# EAGLE design Lightpack5.6 (EAGLE 6.2)
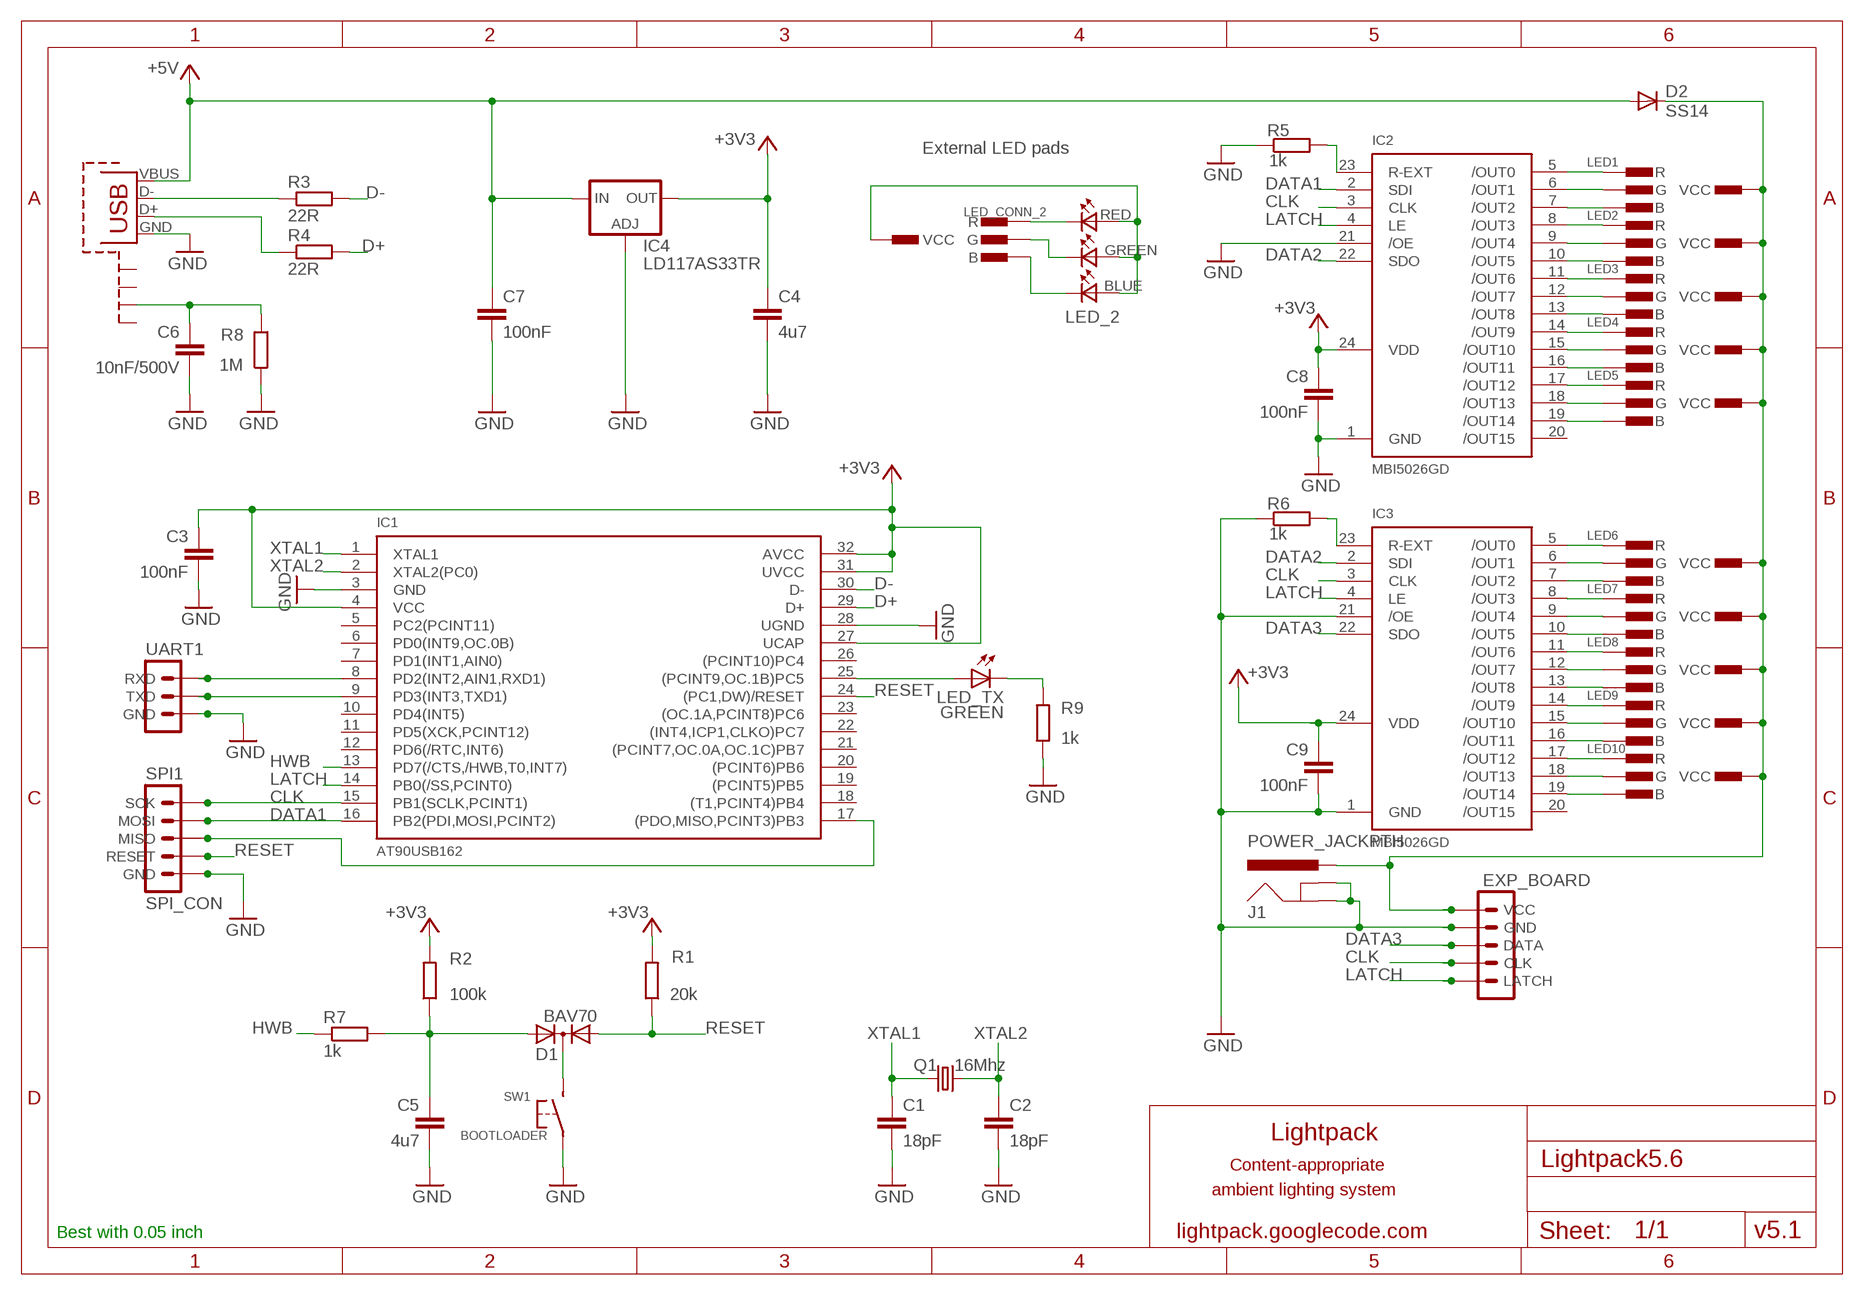
[diagram p0: schematic, sheet 1]

## Parts
C1  18pF  C-EUC1206  [C1206]
C2  18pF  C-EUC1206  [C1206]
C3  100nF  C-EUC1206  [C1206]
C4  4u7  C-EUC1206  [C1206]
C5  4u7  C-EUC1206  [C1206]
C6  10nF/500V  C-EUC1206  [C1206]
C7  100nF  C-EUC1206  [C1206]
C8  100nF  C-EUC1206  [C1206]
C9  100nF  C-EUC1206  [C1206]
D1  BAV70  DIODE-2AC|CASOT23  [SOT23]
D2  SS14  DIODE-SMB  [SMB]
EXP_BOARD  MA05-1  [MA05-1]
IC1  AT90USB162  [TQFP32]
IC2  MBI5026GD  [SOP24-300-1.27]
IC3  MBI5026GD  [SOP24-300-1.27]
IC4  LD117AS33TR  [SOT223]
J1  POWER_JACKPTH  [POWER_JACK_PTH]
LED1  CON-RGB-LED  CON-RGB-LED-TH  [CON-RGB-LED-TH]
LED2  CON-RGB-LED  CON-RGB-LED-TH  [CON-RGB-LED-TH]
LED3  CON-RGB-LED  CON-RGB-LED-TH  [CON-RGB-LED-TH]
LED4  CON-RGB-LED  CON-RGB-LED-TH  [CON-RGB-LED-TH]
LED5  CON-RGB-LED  CON-RGB-LED-TH  [CON-RGB-LED-TH]
LED6  CON-RGB-LED  CON-RGB-LED-TH  [CON-RGB-LED-TH]
LED7  CON-RGB-LED  CON-RGB-LED-TH  [CON-RGB-LED-TH]
LED8  CON-RGB-LED  CON-RGB-LED-TH  [CON-RGB-LED-TH]
LED9  CON-RGB-LED  CON-RGB-LED-TH  [CON-RGB-LED-TH]
LED10  CON-RGB-LED  CON-RGB-LED-TH  [CON-RGB-LED-TH]
LED_2  TOPLED-3RF-W2SA50TS  [LP2C63-ST-RGB-SR0]
LED_CONN_2  CON-RGB-LED  CON-RGB-LED-EXT  [CON-RGB-LED-TH-EXT]
LED_TX  GREEN  LEDCHIPLED_0805  [CHIPLED_0805]
Q1  16Mhz  CRYSTALHC49UP  [HC49UP]
R1  20k  R-EU_R1206  [R1206]
R2  100k  R-EU_R1206_2  [R1206]
R3  22R  R-EU_R1206  [R1206]
R4  22R  R-EU_R1206  [R1206]
R5  1k  R-EU_R1206  [R1206]
R6  1k  R-EU_R1206  [R1206]
R7  1k  R-EU_R1206  [R1206]
R8  1M  R-EU_R1206  [R1206]
R9  1k  R-EU_R1206  [R1206]
SPI1  SPI_CON  [NXT_BRD]
SW1  BOOTLOADER  BUTTON  [BUTTON-SMD]
UART1  UART3  [UART3]
X1  USB-MB-S  [USB-MB-S]

## Nets
+3V3 [VCC]: C3.1 C4.1 C8.1 C9.1 IC1.4(VCC) IC1.27(UCAP) IC1.31(UVCC) IC1.32(AVCC) IC2.24(VDD) IC3.24(VDD) IC4.4(OUT) R1.2 R2.1
+5V [VCC]: C7.1 D2.A IC4.3(IN) X1.VBUS
CLK: EXP_BOARD.2(CLK) IC1.15(PB1(SCLK,PCINT1)) IC2.3(CLK) IC3.3(CLK) SPI1.2(SCK)
D+: IC1.29(D+) R4.2
D-: IC1.30(D-) R3.2
DATA1: IC1.16(PB2(PDI,MOSI,PCINT2)) IC2.2(SDI) SPI1.3(MOSI)
DATA2: IC2.22(SDO) IC3.2(SDI)
DATA3: EXP_BOARD.3(DATA) IC3.22(SDO)
GND: C1.2 C2.2 C3.2 C4.2 C5.2 C6.2 C7.2 C8.2 C9.2 EXP_BOARD.4(GND) IC1.3(GND) IC1.28(UGND) IC2.1(GND) IC2.21(/OE) IC3.1(GND) IC3.21(/OE) IC4.1(ADJ) J1.GND J1.GNDBREAK R5.1 R6.1 R8.1 R9.1 SPI1.1-L(GND) SW1.1 UART1.1-L(GND) X1.GND
HWB: IC1.13(PD7(/CTS,/HWB,T0,INT7)) R7.1
LATCH: EXP_BOARD.1(LATCH) IC1.14(PB0(/SS,PCINT0)) IC2.4(LE) IC3.4(LE)
N$1: IC2.23(R-EXT) R5.2
N$2: IC3.8(/OUT3) LED7.3.R(R)
N$3: IC1.17((PDO,MISO,PCINT3)PB3) SPI1.4(MISO)
N$4: IC1.8(PD2(INT2,AIN1,RXD1)) UART1.2(RXD)
N$5: IC2.5(/OUT0) LED1.3.R(R)
N$6: IC2.6(/OUT1) LED1.2.G(G)
N$7: IC2.7(/OUT2) LED1.1.B(B)
N$8: IC1.25((PCINT9,OC.1B)PC5) LED_TX.A
N$9: IC2.8(/OUT3) LED2.3.R(R)
N$10: IC2.9(/OUT4) LED2.2.G(G)
N$11: IC2.10(/OUT5) LED2.1.B(B)
N$12: IC2.11(/OUT6) LED3.3.R(R)
N$13: IC2.12(/OUT7) LED3.2.G(G)
N$14: IC2.13(/OUT8) LED3.1.B(B)
N$15: IC2.14(/OUT9) LED4.3.R(R)
N$16: IC1.9(PD3(INT3,TXD1)) UART1.3-R(TXD)
N$18: IC3.5(/OUT0) LED6.3.R(R)
N$19: IC3.6(/OUT1) LED6.2.G(G)
N$20: IC3.7(/OUT2) LED6.1.B(B)
N$21: IC3.9(/OUT4) LED7.2.G(G)
N$22: IC3.10(/OUT5) LED7.1.B(B)
N$23: IC3.11(/OUT6) LED8.3.R(R)
N$24: IC3.12(/OUT7) LED8.2.G(G)
N$25: IC3.14(/OUT9) LED9.3.R(R)
N$26: IC3.13(/OUT8) LED8.1.B(B)
N$27: IC3.15(/OUT10) LED9.2.G(G)
N$28: IC3.16(/OUT11) LED9.1.B(B)
N$29: IC2.15(/OUT10) LED4.2.G(G)
N$30: IC2.16(/OUT11) LED4.1.B(B)
N$31: IC3.23(R-EXT) R6.2
N$32: R3.1 X1.D-
N$33: R4.1 X1.D+
N$37: LED_TX.C R9.2
N$38: IC2.17(/OUT12) LED5.3.R(R)
N$39: IC2.18(/OUT13) LED5.2.G(G)
N$40: IC2.19(/OUT14) LED5.1.B(B)
N$41: IC3.17(/OUT12) LED10.3.R(R)
N$42: IC3.18(/OUT13) LED10.2.G(G)
N$43: IC3.19(/OUT14) LED10.1.B(B)
N$44: C6.1 R8.2 X1.SHIELD3
N$45: D1.3(C) SW1.2
N$47: C5.1 D1.2(A2) R2.2 R7.2
N$50: LED_2.CRED LED_CONN_2.3.R(R)
N$51: LED_2.CGREEN LED_CONN_2.2.G(G)
N$52: LED_2.CBLUE LED_CONN_2.1.B(B)
N$54: LED_2.BLUE LED_2.GREEN LED_2.RED LED_CONN_2.4.VCC(VCC)
N$57 [VCC]: D2.C EXP_BOARD.5(VCC) J1.PWR LED1.4.VCC(VCC) LED2.4.VCC(VCC) LED3.4.VCC(VCC) LED4.4.VCC(VCC) LED5.4.VCC(VCC) LED6.4.VCC(VCC) LED7.4.VCC(VCC) LED8.4.VCC(VCC) LED9.4.VCC(VCC) LED10.4.VCC(VCC)
RESET: D1.1(A1) IC1.24((PC1,DW)/RESET) R1.1 SPI1.5-R(RESET)
XTAL1: C1.1 IC1.1(XTAL1) Q1.1
XTAL2: C2.1 IC1.2(XTAL2(PC0)) Q1.2
Unconnected: IC1.5(PC2(PCINT11)) IC1.6(PD0(INT9,OC.0B)) IC1.7(PD1(INT1,AIN0)) IC1.10(PD4(INT5)) IC1.11(PD5(XCK,PCINT12)) IC1.12(PD6(/RTC,INT6)) IC1.18((T1,PCINT4)PB4) IC1.19((PCINT5)PB5) IC1.20((PCINT6)PB6) IC1.21((PCINT7,OC.0A,OC.1C)PB7) IC1.22((INT4,ICP1,CLKO)PC7) IC1.23((OC.1A,PCINT8)PC6) IC1.26((PCINT10)PC4) IC2.20(/OUT15) IC3.20(/OUT15) X1.SHIELD1 X1.SHIELD2 X1.SHIELD4

## Notes on the sheet
- External LED pads
- Lightpack
- Content-appropriate
- ambient lighting system
- Best with 0.05 inch | lightpack.googlecode.com | v5.1

## Library data of the parts
C1-C9 = rcl:C-EU: CAPACITOR, European symbol
D1 = diode:DIODE-2AC|CA: Dual DIODE Anode-Cathode|Cathode-Anode
D2 = diode:DIODE-: DIODE
EXP_BOARD = brd-conn:MA05-1: PIN HEADER
IC1 = AT90USB:AT90USB162: AT90USB162 Author: brunql.github.com
IC2 IC3 = MBI5026:MBI5026: MBI5026 Author: brunql.github.com
IC4 = v-reg:LD117A?*: Low drop fixed and adjustable positive voltage regulators 1 A Source: http://www.st.com/stonline/products/literature/ds/7194/ld1117axx.pdf
J1 = SparkFun:POWER_JACK: Power Jack This is the standard 5.5mm barrel jack for power. The PTH is the most common, proven, reliable, footprint. All others are experimental. The Slot footprint only works if the mill layer is transmitted to the PCB fab house so be warned. Spark Fun Electronics SKU : PRT-00119. Mating wall wart : TOL-00298 (and others)
LED1-LED10 LED_CONN_2 = led-rgb:CON-RGB-LED
LED_2 = led-rgb:TOPLED-3: OSRAM Edited: brunql Removed center pad in pcb - Hyper Multi TOPLED® (RGB) LB E673, LV E673, LT E673 - Power TOPLED® Enhanced optical Power LED (HOP2000) LS E67B, LA E67B, LO E67B, LY E67B - Hyper Multi TOPLED® Enhanced optical Power LED (HOP2000 / ATON®) LATB T66B - Hyper Multi TOPLED® Hyper-Bright LED LATB T686 Source: http://www.osram.convergy.de/
LED_TX = led:LED: LED OSRAM: - CHIPLED LG R971, LG N971, LY N971, LG Q971, LY Q971, LO R971, LY R971 LH N974, LH R974 LS Q976, LO Q976, LY Q976 LO Q996 - Hyper CHIPLED LW Q18S LB Q993, LB Q99A, LB R99A - SideLED LS A670, LO A670, LY A670, LG A670, LP A670 LB A673, LV A673, LT A673, LW A673 LH A674 LY A675 LS A676, LA A676, LO A676, LY A676, LW A676 LS A679, LY A679, LG A679 - Hyper Micro SIDELED® LS Y876, LA Y876, LO Y876, LY Y876 LT Y87S - SmartLED LW L88C, LW L88S LB L89C, LB L89S, LG L890 LS L89K, LO L89K, LY L89K LS L896, LA L896, LO L896, LY L896 - TOPLED LS T670, LO T670, LY T670, LG T670, LP T670 LSG T670, LSP T670, LSY T670, LOP T670, LYG T670 LG T671, LOG T671, LSG T671 LB T673, LV T673, LT T673, LW T673 LH T674 LS T676, LA T676, LO T676, LY T676, LB T676, LH T676, LSB T676, LW T676 LB T67C, LV T67C, LT T67C, LS T67K, LO T67K, LY T67K, LW E67C LS E67B, LA E67B, LO E67B, LY E67B, LB E67C, LV E67C, LT E67C LW T67C LS T679, LY T679, LG T679 LS T770, LO T770, LY T770, LG T770, LP T770 LB T773, LV T773, LT T773, LW T773 LH T774 LS E675, LA E675, LY E675, LS T675 LS T776, LA T776, LO T776, LY T776, LB T776 LHGB T686 LT T68C, LB T68C - Hyper Mini TOPLED® LB M676 - Mini TOPLED Santana® LG M470 LS M47K, LO M47K, LY M47K Source: http://www.osram.convergy.de LUXEON: - LUMILED® LXK2-PW12-R00, LXK2-PW12-S00, LXK2-PW14-U00, LXK2-PW14-V00 LXK2-PM12-R00, LXK2-PM12-S00, LXK2-PM14-U00 LXK2-PE12-Q00, LXK2-PE12-R00, LXK2-PE12-S00, LXK2-PE14-T00, LXK2-PE14-U00 LXK2-PB12-K00, LXK2-PB12-L00, LXK2-PB12-M00, LXK2-PB14-N00, LXK2-PB14-P00, LXK2-PB14-Q00 LXK2-PR12-L00, LXK2-PR12-M00, LXK2-PR14-Q00, LXK2-PR14-R00 LXK2-PD12-Q00, LXK2-PD12-R00, LXK2-PD12-S00 LXK2-PH12-R00, LXK2-PH12-S00 LXK2-PL12-P00, LXK2-PL12-Q00, LXK2-PL12-R00 Source: www.luxeon.com KINGBRIGHT: KA-3528ASYC Source: www.kingbright.com
Q1 = crystal:CRYSTAL: CRYSTAL
R1 R2 R5 R6 = br-zero-res:R-EU_: RESISTOR, European symbol
R3 R4 R7-R9 = rcl:R-EU_: RESISTOR, European symbol
SPI1 = brd-conn:SPI_CON
SW1 = button-smd:BUTTON: Button SMD
UART1 = brd-conn:UART3: PIN HEADER
X1 = USB_miniB:USB: USB Connector miniUSB type B

## Net classes
1 VCC: width 0.6 mm, clearance 0.6 mm

## Board
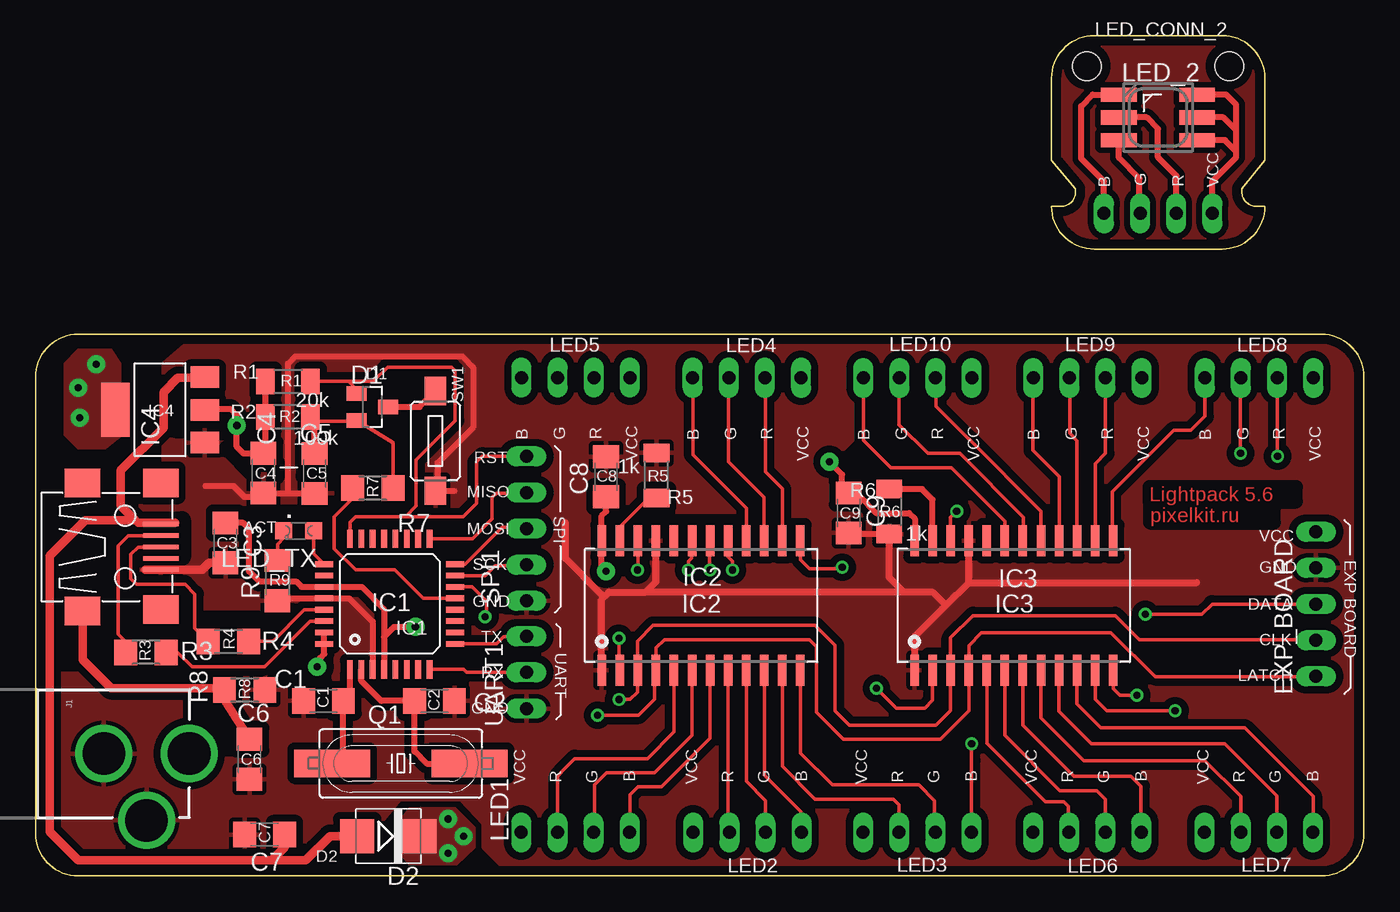
[diagram p1: board, top side]
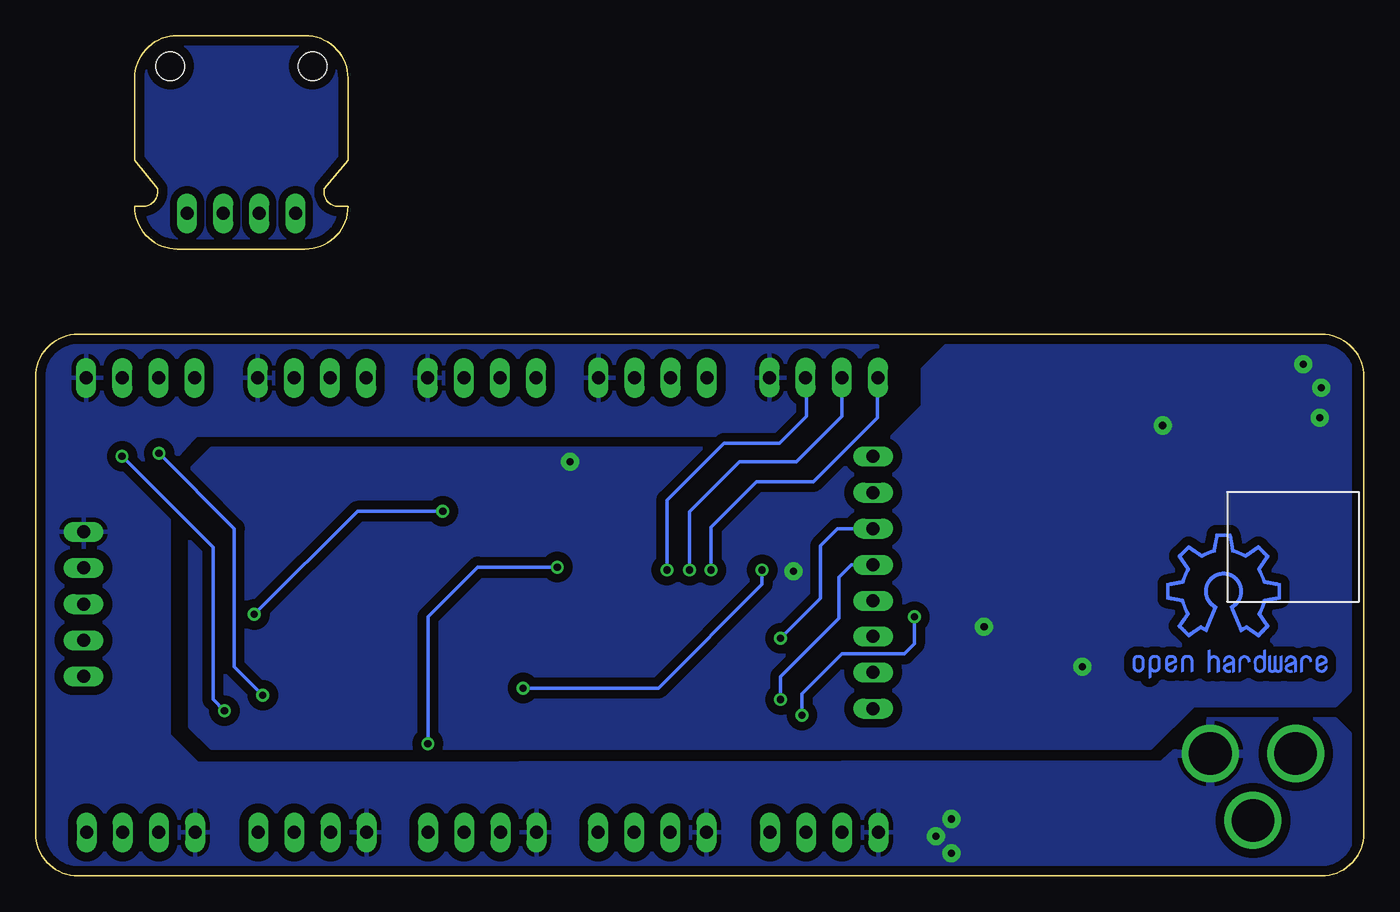
[diagram p2: board, bottom side, seen from below]

Size 93.38 x 59.05 mm. Coordinates in mm from the lower left corner, seen from the top.
Outline: 0,3 arc90 3,0 90.38,0 arc90 93.38,3 93.38,35.06 arc90 90.38,38.06 3,38.06 arc90 0,35.06 0,3
Outline: 71.41,47.05 arc90 74.41,44.05 83.41,44.05 arc90 86.41,47.05 85.8,47.05 arc-90 84.8,48.05 84.8,48.3 86.41,50.28 86.41,56.05 arc90 83.41,59.05 74.41,59.05 arc90 71.41,56.05 71.41,50.28 73.1,48.3 73.1,48.05 arc-90 72.1,47.05 71.41,47.05
Copper layers (1*16): Top 0.035mm / dielectric 1.5mm / Bottom 0.035mm
Design rules: minimum track width 10mil, minimum drill 24mil, track to track 8mil, track to pad 8mil, pad to pad 8mil, via to via 8mil, smd to smd 8mil, copper to edge 25mil, drill to drill 8mil, minimum pad ring 10mil, minimum via ring 8mil, stop-mask expansion 4mil, vias tented up to drill 0mil, thermal gap 12mil
Holes 2 mm at 73.9,56.9 83.9,56.9
tRestrict: area 83,53.7 to 84,54.5; area 83,52 to 83.9,52.9; 29 lines

### Footprints (pad centres in the part's own frame; a part is rotated, then mirrored left to right if it is on the bottom)
C1206 = smd 1.6 x 1.8: 1 -1.4,0; 2 1.4,0
SOT23 = smd 1 x 1.4: 1 -0.95,-1.1; 2 0.95,-1.1; 3 0,1.1
SMB = smd 2.4 x 2.4: A 2.2,0; C -2.2,0
MA05-1 = drill 0.914 long: 1 -5.08,0; 2 -2.54,0; 3 0,0; 4 2.54,0; 5 5.08,0
TQFP32 = smd 1.27 x 0.4: 1 -4.61,2.82; 2 -4.61,2.02; 3 -4.61,1.22; 4 -4.61,0.42; 5 -4.61,-0.38; 6 -4.61,-1.18; 7 -4.61,-1.98; 8 -4.61,-2.78; 17 4.59,-2.78; 18 4.59,-1.98; 19 4.59,-1.18; 20 4.59,-0.38; 21 4.59,0.42; 22 4.59,1.22; 23 4.59,2.02; 24 4.59,2.82 | smd 0.4 x 1.27: 9 -2.81,-4.58; 10 -2.01,-4.58; 11 -1.21,-4.58; 12 -0.41,-4.58; 13 0.39,-4.58; 14 1.19,-4.58; 15 1.99,-4.58; 16 2.79,-4.58; 25 2.79,4.62; 26 1.99,4.62; 27 1.19,4.62; 28 0.39,4.62; 29 -0.41,4.62; 30 -1.21,4.62; 31 -2.01,4.62; 32 -2.81,4.62
SOP24-300-1.27 = smd 0.6 x 2.2: 1 -6.85,-4.635; 2 -5.58,-4.635; 3 -4.31,-4.635; 4 -3.04,-4.635; 5 -1.77,-4.635; 6 -0.5,-4.635; 7 0.77,-4.635; 8 2.04,-4.635; 9 3.31,-4.635; 10 4.58,-4.635; 11 5.85,-4.635; 12 7.12,-4.635; 13 7.12,4.47; 14 5.85,4.47; 15 4.58,4.47; 16 3.31,4.47; 17 2.04,4.47; 18 0.77,4.47; 19 -0.5,4.47; 20 -1.77,4.47; 21 -3.04,4.47; 22 -4.31,4.47; 23 -5.58,4.47; 24 -6.85,4.47
SOT223 = smd 1.5 x 2: 1 -2.3,-3.15; 2 0,-3.15; 3 2.3,-3.15 | smd 3.8 x 2: 4 0,3.15
POWER_JACK_PTH = drill 2.997: GND 0,7.7; GNDBREAK 4.7,10.7; PWR 0,13.7
CON-RGB-LED-TH = drill 0.914 long: 1.B 0,-3.81; 2.G 0,-1.27; 3.R 0,1.27; 4.VCC 0,3.81
LP2C63-ST-RGB-SR0 = smd 2.5 x 1: BLUE 2.75,1.6; CBLUE -2.75,1.6; CGREEN -2.75,-1.6; CRED -2.75,0; GREEN 2.75,-1.6; RED 2.75,0
CON-RGB-LED-TH-EXT = drill 0.914 long: 1.B 0,-3.81; 2.G 0,-1.27; 3.R 0,1.27; 4.VCC 0,3.81
CHIPLED_0805 = smd 1.2 x 1.2: A 0,-1.05; C 0,1.05
HC49UP = smd 5.334 x 1.93: 1 -4.826,0; 2 4.826,0
R1206 = smd 1.3 x 1.803: 1 -1.581,0; 2 1.581,0
R1206' = smd 1.6 x 1.803: 1 -1.422,0; 2 1.422,0
NXT_BRD = drill 0.914 long: 1-L -5.08,0; 2 -2.54,0; 3 0,0; 4 2.54,0; 5-R 5.08,0
BUTTON-SMD = smd 2 x 1.5: 1 -3.5,0; 2 3.5,0
UART3 = drill 0.914 long: 1-L -2.54,0; 2 0,0; 3-R 2.54,0
USB-MB-S = smd 2.5 x 0.32: D+ 2.5,0; D- 2.5,0.8; GND 2.5,-1.6; ID 2.5,-0.8; VBUS 2.5,1.6 | smd 2.5 x 2: SHIELD1 2.5,4.5; SHIELD2 -3,4.5; SHIELD3 -3,-4.5; SHIELD4 2.5,-4.4

### Placement (x,y rotation side)
C1  20.23,12.3 180 top
C2  28.04,12.3 0 top
C3  13.35,23.4 270 top
C4  16.02,28.3 270 top
C5  19.61,28.28 270 top
C6  15.04,8.2 270 top
C7  16.1,2.9 180 top
C8  40.1,28.05 90 top
C9  57.15,25.5 270 top
D1  23.68,32.95 270 top
D2  24.8,2.8 180 top
EXP_BOARD  90,19.1 90 top
IC1  24.91,19.12 90 top
IC2  46.65,19.09 0 top
IC3  68.63,19.09 0 top
IC4  8.75,32.75 90 top
J1  -2.9,8.6 270 top
LED1  37.95,3.06 90 top
LED2  50.03,3.06 90 top
LED3  61.98,3.06 90 top
LED4  50,35 270 top
LED5  37.97,35.02 270 top
LED6  73.92,3.06 90 top
LED7  85.98,3.06 90 top
LED8  86,35 270 top
LED9  73.94,35 270 top
LED10  62,35 270 top
LED_2  78.9,53.3 0 top
LED_CONN_2  78.91,46.55 270 top
LED_TX  18.5,24.25 90 top
Q1  25.68,7.91 0 top
R1  17.75,34.75 180 top
R2  17.75,32.25 0 top
R3  22R  [R1206']  7.76,15.71 0 top
R4  22R  [R1206']  13.56,16.47 0 top
R5  43.65,28.14 270 top
R6  60.01,25.6 90 top
R7  1k  [R1206']  23.71,27.25 0 top
R8  1M  [R1206']  14.7,13.07 180 top
R9  1k  [R1206']  17,20.75 90 top
SPI1  34.5,24.4 90 top
SW1  28.11,30.56 90 top
UART1  34.5,14.3 90 top
X1  6.3,23.12 0 top

### Tracks (layer width: path | path; a pad name or v marks a point on that pad's centre or on a via)
+3V3  (via drill 0.5 pad 1.27)
  Top 0.305: 56.7,26.95 C9.1 56.95,26.7 57.9,26.7 | 61.8,23.58 IC3.24 | 39.8,23.8 IC2.24 39.75,23.6
  Top 0.406: IC1.31 IC1.32 20.3,15.6 20,15.3 20,14.9 v19.8,14.7 | C4.1 16.17,29.85 R2.1 R1.2 16.25,34.83 | C4.1 15.98,29.75 | C9.1 56.85,26.9 | 56.7,26.95 56.7,28.2 v55.8,29.1 | 57.9,26.7 59.1,25.5 61.4,25.5 61.8,25.1 61.8,23.58 | IC1.4 24.5,16.8 | 24.5,16.8 24.5,18.75 22.94,20.31 IC1.27 18.69,20.31 18.3,20.7 15.7,20.7 15,21.4 15,24.4 14.6,24.8 C3.1 | v26.7,17.5 25.2,17.5 24.5,16.8 | v40.1,21.4 39.8,21.7 IC2.24 39.8,25.3 40.1,25.6 C8.1 | C4.1 14.6,29.7 14.15,30.15 v14.15,31.65 14.15,32.35 13.7,32.8 11.9,32.8
  other vias: 4.25,35.95 3,34.3 3.1,32.2
  pour Bottom (isolate 0.61): 2,12 12,12 15,9 81,9 82.5,10.5 82.5,28.5 81,30 34,30 31,33 31,35.6 29,37.6 1,37.6 1,13
  pour Top (no thermals): 6,36 5.3,37 3,37 2,36 2,31 3,30 4.9,30 6,30.9
+5V
  Top 0.254: 9.8,24.8 8.89,24.8 X1.VBUS
  Top 0.61: D2.A 20.7,2.8 19,1.1 16.6,1.1 | 16.6,1.1 3,1.1 1,3.1 1,22.5 3.5,25 7,25 | C7.1 17.5,2 16.6,1.1 | IC4.3 11.85,35 10,35 9,34 9,31.5 6,28.5 6,26 7,25 | 7,25 7.2,24.8 9.8,24.8
CLK  (via drill 0.5)
  Top 0.254: IC1.15 31.61,21.11 32.3,21.8 34.44,21.8 SPI1.2 | v41,12.4 41.8,12.4 42.3,12.9 42.3,14.42 IC2.3 42.3,14.49 42.3,16.5 43.4,17.6 54.8,17.6 56.2,16.2 56.2,11.6 57.2,10.6 63.3,10.6 64.3,11.6 64.3,14.43 IC3.3 64.32,16.72 65.9,18.3 75.9,18.3 77.6,16.6 89.96,16.6 EXP_BOARD.2
  Bottom 0.254: SPI1.2 36.04,21.86 36.9,21 36.9,18.1 41,14 v41,12.4
D+
  Top 0.254: IC1.29 18.89,18.71 18.89,18.7 16.7,16.5 15.02,16.5
  Top 0.305: R4.2 15.02,16.5
  Top 0.406: 14.92,15.94 14.92,15.93 R4.2
D-
  Top 0.254: IC1.30 19.31,17.91 16.1,14.7 11,14.7 10,15.7 R3.2
DATA1  (via drill 0.5)
  Top 0.254: IC1.16 30.21,21.91 32.8,24.5 34.4,24.5 SPI1.3 | v41,16.7 41,14.52 IC2.2
  Top 0.406: IC2.2 41,13.69
  Bottom 0.254: SPI1.3 37,24.4 38.2,23.2 38.2,19.5 v41,16.7
DATA2  (via drill 0.5)
  Top 0.254: IC3.2 63.05,12.35 62.5,11.8 60.5,11.8 v59.1,13.2 | 42.35,22.87 42.35,21.55 v42.3,21.5
  Top 0.305: 42.35,22.87 IC2.22
  Bottom 0.254: v42.3,21.5 42.3,20.5 49.6,13.2 v59.1,13.2
DATA3  (via drill 0.5)
  Top 0.254: IC3.22 64.32,25.2 v64.75,25.62 | v78,18.38 81.97,18.38 82.7,19.1 EXP_BOARD.3
  Bottom 0.254: v64.75,25.62 70.75,25.62 v78,18.38
GND
  Top 0.254: 7.7,21.5 8.79,21.5 X1.GND
  Top 0.305: 39.8,19.44 39.8,19.77 | 42.88,19.94 42.91,19.97 | R6.1 60,24.01
  Top 0.406: IC1.3 23.7,17.87 22.05,19.51 IC1.28 17.17,19.5 R9.1 | 17.75,26.91 C4.2 15.75,26.63 14.67,26.63 13.9,27.4 11.95,27.4 | 17.75,26.91 19.59,26.91 C5.2 | 17.75,26.91 17.75,36 18.25,36.5 30,36.5 30.75,35.75 30.75,31.5 28.25,29 28.25,27.21 SW1.1 29.43,27.07 | R6.1 57.83,24.02 C9.2
  Top 0.5: IC2.1 39.8,19.44 40.3,19.94 42.88,19.94 | IC2.21 43.6,20.67 42.91,19.97 61,19.97 | 39.8,19.77 37.25,22.31 37.25,24.85 | IC3.1 61.78,16.8 63.99,19.01 | 65.59,20.61 IC3.21 | 63.99,19.01 65.59,20.61 | 61,19.97 63.03,19.97 63.99,19.01 | R6.1 60.01,20.96 61,19.97 | 65.59,20.61 81.61,20.61
  Top 0.61: 7.7,21.5 11.7,21.5 12.2,22 C3.2
  pour Top (isolate 0.5): 0.5,25.6 0.5,0.7 0.4,0.3 23,0.4 24.1,1.5 24.1,3.6 25.6,5.4 29.9,5.4 31.5,3.7 31.5,2 33.1,0.4 93.1,0.4 93.1,37.7 11,37.7 9,36 9,27 2,27
HWB
  Top 0.254: IC1.13 27.25,19.5 25.25,21.5 22.5,21.5 21,23 21,25.25 22.29,26.54
  Top 0.406: IC1.13 | 22.29,26.54 R7.1
LATCH  (via drill 0.5)
  Top 0.254: IC1.14 30.69,20.31 31.7,19.3 31.7,18.3 v31.6,18.2 | 43.5,13.65 43.5,12.4 42.4,11.3 v39.5,11.3 | 43.62,15.12 43.62,16.02 44.2,16.6 54.4,16.6 54.9,16.1 54.9,11.5 56.8,9.6 63.6,9.6 65.6,11.6 IC3.4 65.59,16.19 66.5,17.1 75.6,17.1 78.7,14 89.98,14 EXP_BOARD.1
  Top 0.305: IC2.4 43.6,15.11 43.62,15.12
  Top 0.406: 43.5,13.65 IC2.4
  Bottom 0.254: v39.5,11.3 39.5,12.8 36.7,15.6 32.3,15.6 31.6,16.3 v31.6,18.2
N$1
  Top 0.254: R5.2 42.84,26.28 41.06,24.51
  Top 0.305: IC2.23 41.06,24.51
N$2
  Top 0.254: IC3.8 70.67,11.13 73.7,8.1 82.2,8.1 84.71,5.59 LED7.3.R
N$3
  Top 0.254: IC1.17 30.71,23.71 32.1,25.1 32.1,26.6 32.4,26.9 34.46,26.9 SPI1.4
  Top 0.305: IC1.17 27.7,24.01
N$4
  Top 0.254: IC1.8 30.09,14.51 30.3,14.3 UART1.2
N$5
  Top 0.254: IC2.5 44.88,10.12 43,8.25 37.9,8.25 36.95,7.3 36.95,7.25 36.7,7 36.7,3.08
  Top 0.305: LED1.3.R 36.7,3.08
N$6
  Top 0.254: IC2.6 46.15,9.89 43.5,7.25 40.15,7.25 39.3,6.4 39.3,3.14
  Top 0.305: LED1.2.G 39.3,3.14
N$7
  Top 0.254: IC2.7 47.41,9.66 44,6.25 42.35,6.25 41.8,5.7 41.8,3.1
  Top 0.305: LED1.1.B 41.8,3.1
N$8
  Top 0.254: LED_TX.A 19.55,22.65 IC1.25
N$9
  Top 0.254: IC2.8 48.69,3.14 LED2.3.R
N$10
  Top 0.254: IC2.9 49.95,6.64 51.3,5.3 LED2.2.G
N$11
  Top 0.254: IC2.10 51.23,7.07 53.8,4.5 53.8,3.1 LED2.1.B
N$12
  Top 0.254: IC2.11 52.49,7.71 54.8,5.4 60.3,5.4 60.7,5 LED3.3.R
N$13
  Top 0.254: IC2.12 53.77,8.63 56,6.4 62.1,6.4 63.2,5.3 63.2,3.1 LED3.2.G
N$14  (via drill 0.5)
  Top 0.254: IC2.13 53.77,22.23 54.4,21.6 56.6,21.6 | LED3.1.B 65.78,8.12 v65.8,9.3
  Top 0.305: v56.7,21.7 56.6,21.6
  Bottom 0.254: v56.7,21.7 62.3,21.7 65.8,18.2 v65.8,9.3
N$15
  Top 0.254: IC2.14 52.49,27.2 51.3,28.4 51.3,34.97 LED4.3.R
N$16
  Top 0.254: IC1.9 32.41,16.31 32.9,16.8 34.46,16.8 UART1.3-R
N$18
  Top 0.254: IC3.5 66.86,9.34 71,5.2 72.3,5.2 72.6,4.9 72.6,3.1 LED6.3.R
N$19
  Top 0.254: IC3.6 68.13,9.87 72,6 74.6,6 75.2,5.4 75.2,3.07 LED6.2.G
N$20
  Top 0.254: IC3.7 69.4,10.6 73,7 77,7 77.7,6.3 77.7,3.08 LED6.1.B
N$21
  Top 0.254: IC3.9 71.94,11.56 74.2,9.3 83.6,9.3 87.25,5.65 LED7.2.G
N$22
  Top 0.254: IC3.10 73.21,12.09 74.9,10.4 85,10.4 89.8,5.6 LED7.1.B
N$23  (via drill 0.5)
  Top 0.254: 74.5,13.73 74.5,12.4 75.3,11.6 v80.1,11.6 | v87.3,29.5 87.3,34.97 LED8.3.R
  Top 0.305: 74.5,13.73 IC3.11
  Bottom 0.254: v80.1,11.6 80.9,12.4 80.9,23.1 v87.3,29.5
N$24  (via drill 0.5)
  Top 0.254: IC3.12 75.75,13.15 76.2,12.7 v77.4,12.7 | v84.7,29.7 84.7,34.96 LED8.2.G
  Bottom 0.254: v77.4,12.7 79.4,14.7 79.4,24.4 v84.7,29.7
N$25
  Top 0.254: IC3.14 74.48,28.98 75.2,29.7 75.2,34.99 LED9.3.R
N$26
  Top 0.254: IC3.13 75.7,23.61 75.7,27 80,31.3 81.2,31.3 82.2,32.3 LED8.1.B
N$27
  Top 0.254: IC3.15 73.21,30.59 72.7,31.1 72.7,34.97 LED9.2.G
N$28
  Top 0.254: 71.95,22.87 71.95,28.05 70.1,29.9 70.1,34.97 LED9.1.B
  Top 0.305: 71.95,22.87 IC3.16
N$29
  Top 0.254: 51.2,23.58 51.2,26.6 48.7,29.1 48.7,34.97 LED4.2.G
  Top 0.305: IC2.15 51.2,23.58
N$30
  Top 0.254: IC2.16 49.95,25.84 46.2,29.6 LED4.1.B
N$31
  Top 0.406: R6.2 62.32,27.18 63.05,26.45 IC3.23
N$32
  Top 0.254: R3.1 6.3,15.75 6.3,16.5 5.8,17 5.8,23.2 6.5,23.9 8.79,23.9 X1.D-
N$33
  Top 0.254: R4.1 11.2,17.41 11.2,19.8 10.5,20.5 7.1,20.5 6.7,20.9 6.7,22.6 7.2,23.1 8.79,23.1 X1.D+
  Top 0.305: 12.11,15.9 R4.1 12.11,16.5
  Top 0.406: 11.68,15.88 12.12,15.88 R4.1
N$37
  Top 0.254: 17.45,23.95 17.45,23.75 17,23.3 R9.2
  Top 0.406: 17.45,23.95 LED_TX.C
N$38  (via drill 0.5)
  Top 0.254: 48.65,22.89 48.65,22.45 49,22.1 v49,21.5
  Top 0.305: 48.62,22.92 IC2.17 48.65,22.89 48.65,24.5
  Bottom 0.254: LED5.3.R 39.2,34.98 39.2,32.3 41.1,30.4 45,30.4 49,26.4 v49,21.5
N$39  (via drill 0.5)
  Top 0.254: 47.38,22.9 47.38,21.52 v47.4,21.5
  Top 0.305: IC2.18 47.38,22.9 47.38,24.19 47.4,24.21
  Bottom 0.254: LED5.2.G 36.7,32.3 39.9,29.1 43.9,29.1 47.4,25.6 v47.4,21.5
N$40  (via drill 0.5)
  Top 0.254: 46.12,22.88 46.12,22.32 45.9,22.1 v45.9,21.5
  Top 0.305: 46.12,22.88 IC2.19 | IC2.19 46.05,22.95 | IC2.19 46.15,22.86
  Bottom 0.254: LED5.1.B 34.2,34.98 34.2,32.2 38.7,27.7 42.7,27.7 45.9,24.5 v45.9,21.5
N$41
  Top 0.254: IC3.17 70.67,25.64 65.62,30.69 65.61,30.69 63.3,33 63.3,34.97 LED10.3.R
N$42
  Top 0.254: 69.45,22.91 69.45,25.2 64.96,29.69 62.71,29.69 60.7,31.7 60.7,34.97 LED10.2.G
  Top 0.305: 69.45,22.91 IC3.18
N$43
  Top 0.254: IC3.19 68.13,24.93 64.38,28.69 60.11,28.69 58.2,30.6 58.2,34.99 LED10.1.B
N$44
  Top 0.61: R8.2 13.35,12.8 | R8.2 13.38,12.26 C6.1 | R8.2 13.2,13 | X1.SHIELD3 3.3,15.2 5.3,13.2 13.15,13.2 R8.2
N$45
  Top 0.406: D1.3 27,32.95 SW1.2
N$47
  Top 0.254: R7.2 25.14,30.45 D1.2 | 19.61,31.97 22.54,31.97
  Top 0.406: C5.1 19.61,31.97 R2.2 | 22.54,31.97 D1.2
N$50
  Top 0.406: LED_2.CRED 78.1,53.3 78.9,52.5 78.9,50.5 80.2,49.2 80.2,46.57 LED_CONN_2.3.R
N$51
  Top 0.406: LED_2.CGREEN 76.15,50.45 77.6,49 77.6,46.59 LED_CONN_2.2.G
N$52
  Top 0.406: 75.2,46.65 LED_CONN_2.1.B 75.1,48.8 73.5,50.4 73.5,54.1 74.3,54.9 LED_2.CBLUE
N$54
  Top 0.406: LED_2.BLUE 83.7,54.9 84.4,54.2 84.4,52.4 | 84.4,50.9 84.4,50.5 82.7,48.8 82.7,46.57 LED_CONN_2.4.VCC | 84.4,50.9 84.4,52.4 | LED_2.RED 83.5,53.3 84.4,52.4 | LED_2.GREEN 83.6,51.7 84.4,50.9
N$57  (via drill 0.5 pad 1.27)
  other vias: 29,1.6 30.1,2.8 29,4
  pour Bottom (isolate 0.1): 1,0.7 1,10 2,11 11,11 14.1,8 82,7.9 84,9.9 84,28.9 82.4,30.7 82.1,31 34.5,31 32.5,33 32.5,35.5 34.5,37.5 93.7,37.5 93.7,0.6
  pour Top (no thermals): 25.7,4 26.3,4.8 29.5,4.8 30.9,3.4 30.9,2 29.6,0.8 26.3,0.8 25.7,1.5
  pour Bottom: 8.9,10.8 10.9,10.8 14,8 14,6 10,6 8,8 8,10
RESET
  Top 0.254: IC1.24 22.09,24.84 22.5,25.25 26,25.25 | 22,34.75 23.73,34.75 24.73,35.75 29.25,35.75 29.5,35.5 29.5,32 26.75,29.25 26.75,26 26,25.25 | 22,34.75 R1.1 | 22,34.75 22.58,34.17 | 26,25.25 30.05,25.25 31,26.2 31,29.1 31.4,29.5 34.48,29.5 SPI1.5-R
  Top 0.406: 22.58,34.17 D1.1
S$2
  pour Top (isolate 0.406): 73.5,58.8 84.4,58.8 86.2,57 86.2,49.9 84.4,48.1 84.4,47.7 85.3,46.8 86.2,46.8 86.2,46 84.4,44.2 73.5,44.2 71.7,46 71.7,46.9 72.6,46.9 73.4,47.7 73.4,48.7 71.7,50.4 71.7,57
  pour Top (isolate 0.406): 73.5,58.8 84.4,58.8 86.2,57 86.2,49.9 84.4,48.1 84.4,47.7 85.3,46.8 86.2,46.8 86.2,46 84.4,44.2 73.5,44.2 71.7,46 71.7,46.9 72.6,46.9 73.4,47.7 73.4,48.7 71.7,50.4 71.7,57
  pour Bottom (isolate 0.5): 73.5,58.8 84.4,58.8 86.2,57 86.2,49.9 84.4,48.1 84.4,47.7 85.3,46.8 86.2,46.8 86.2,46 84.4,44.2 73.5,44.2 71.7,46 71.7,46.9 72.6,46.9 73.4,47.7 73.4,48.7 71.7,50.4 71.7,57
XTAL1
  Top 0.305: 22.09,14.16 IC1.1
  Top 0.406: 22.09,14.16 22.09,12.76 C1.1 21.64,7.87 21.7,7.8 20.96,7.8 Q1.1
XTAL2
  Top 0.406: IC1.2 22.89,13.71 24.3,12.3 C2.1 26.64,8.76 27.5,7.9 Q1.2 30.49,8.5
(copper drawn outside any net)
  shapes: Bottom area x6913

### Text on the board
Top: Lightpack 5.6 | pixelkit.ru
tPlace: D1 | R1 | IC4 | R2 | RST | C4 | C5 | C8 | R5 | R7 | MISO | SPI | C9 | R6 | ACT | MOSI | VCC | C3 | SCK | EXP BOARD | GND | R9 | IC1 | GND | DATA | IC2 | IC3 | R4 | TX | UART | CLK | R3 | RX | LATCH | R8 | C1 | C2 | GND | C6 | C7 | D2
tTest: C:/Users/Panda/Desktop/Untitled-1.bmp | C:/Users/Panda/Desktop/Untitled-1.bmp | C:/Users/Panda/Desktop/Untitled-1.bmp